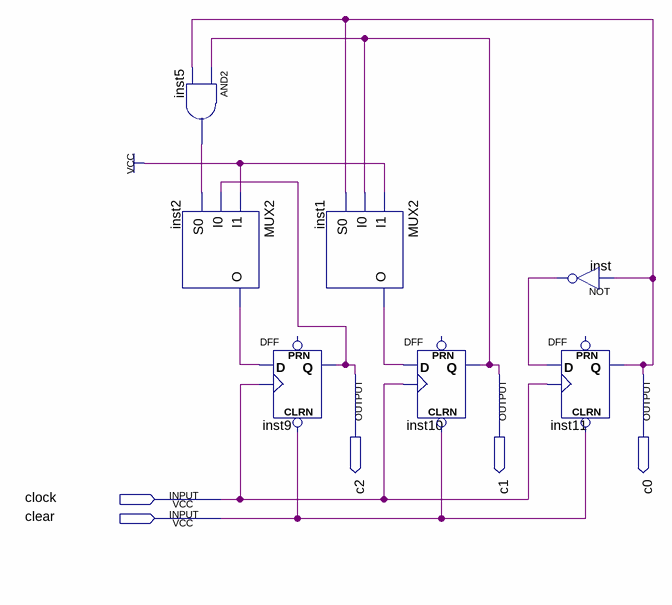
[diagram p0: schematic sheet]
// Quartus schematic counter3.bdf as structural Verilog: 7 symbols, 5 pins
module counter3 (
  input  clock,
  input  clear,
  output c2,
  output c1,
  output c0
);

  wire inst1_o, inst2_o, inst5_out, inst_out;

  and inst5 (inst5_out, c1, c0);
  MUX2 inst2 (.I1(1'b1), .I0(c2), .S0(inst5_out), .O(inst2_o));
  DFF inst9 (.CLRN(clear), .CLK(clock), .D(inst2_o), .Q(c2));  // open: PRN
  MUX2 inst1 (.I1(1'b1), .I0(c1), .S0(c0), .O(inst1_o));
  DFF inst10 (.CLRN(clear), .CLK(clock), .D(inst1_o), .Q(c1));  // open: PRN
  not inst (inst_out, c0);
  DFF inst11 (.CLRN(clear), .CLK(clock), .D(inst_out), .Q(c0));  // open: PRN
endmodule
